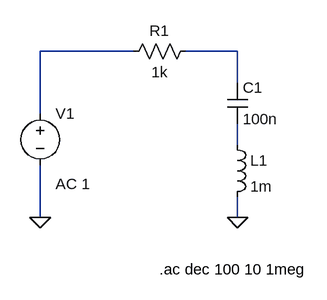
[diagram p0: schematic Band stop filter.asc]
Band stop filter.asc, the LTspice schematic file:
Version 4
SHEET 1 880 680
WIRE 144 0 0 0
WIRE 304 0 224 0
WIRE 304 48 304 0
WIRE 0 96 0 0
WIRE 304 144 304 112
WIRE 0 256 0 176
WIRE 304 256 304 224
FLAG 0 256 0
FLAG 304 256 0
SYMBOL voltage 0 80 R0
WINDOW 123 24 124 Left 2
WINDOW 39 0 0 Left 0
SYMATTR Value2 AC 1
SYMATTR InstName V1
SYMATTR Value ""
SYMBOL res 240 -16 R90
WINDOW 0 0 56 VBottom 2
WINDOW 3 32 56 VTop 2
SYMATTR InstName R1
SYMATTR Value 1k
SYMBOL ind 288 128 R0
SYMATTR InstName L1
SYMATTR Value 1m
SYMBOL cap 288 48 R0
SYMATTR InstName C1
SYMATTR Value 100n
TEXT 184 336 Left 2 !.ac dec 100 10 1meg

The netlist it stands for:
* Band stop filter.asc
V1 N001 0 AC 1
R1 N002 N001 1k
L1 N003 0 1m
C1 N002 N003 100n
.ac dec 100 10 1meg
.backanno
.end